# Altium schematic sheet Tactical_LED_Light.SchDoc
size A4
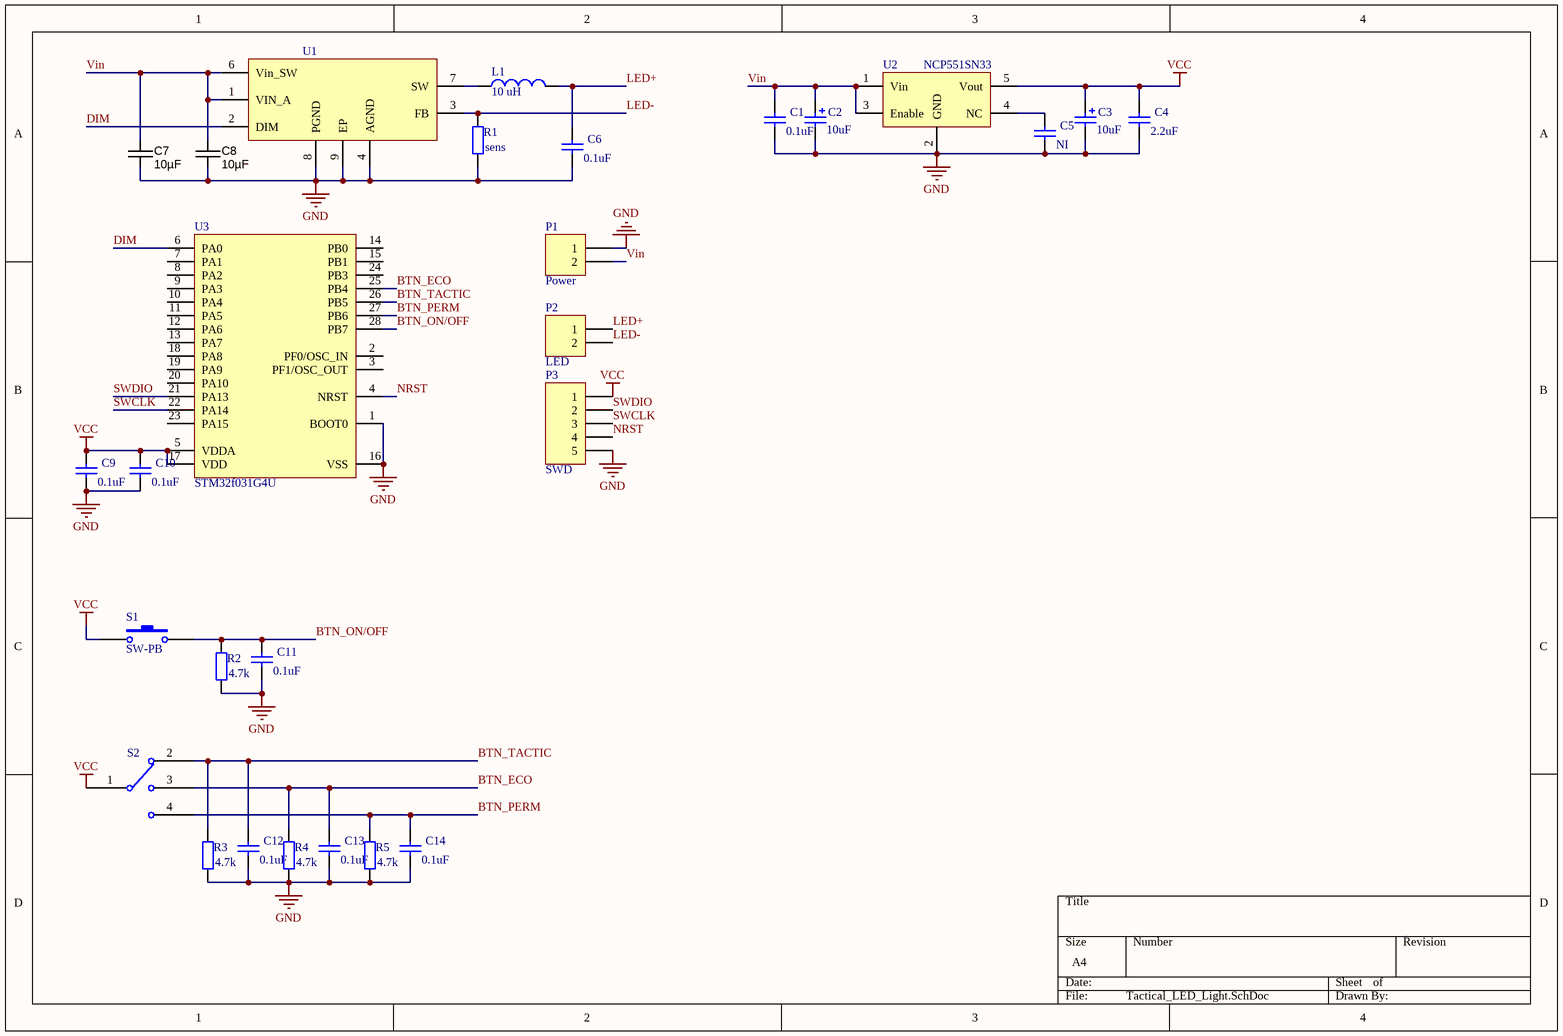
[diagram p0: Tactical_LED_Light.SchDoc]

## Parts
C1  value 0.1uF  [CAPC1608X90N]  (hidden comment: Cap)
C2  value 10uF  [CAPMP3528X210N]  (hidden comment: Cap Pol2)
C3  value 10uF  [CAPMP3528X210N]  (hidden comment: Cap Pol2)
C4  value 2.2uF  [CAPC1608X90N]  (hidden comment: Cap)
C5  value NI  [CAPC1608X90N]  (hidden comment: Cap)
C6  value 0.1uF  [CAPC1608X90N]  (hidden comment: Cap)
C7  10µF  [CAPC3216X100N]
C8  10µF  [CAPC3216X100N]
C9  value 0.1uF  [CAPC1608X90N]  (hidden comment: Cap)
C10  value 0.1uF  [CAPC1608X90N]  (hidden comment: Cap)
C11  value 0.1uF  [CAPC1608X90N]  (hidden comment: Cap)
C12  value 0.1uF  [CAPC1608X90N]  (hidden comment: Cap)
C13  value 0.1uF  [CAPC1608X90N]  (hidden comment: Cap)
C14  value 0.1uF  [CAPC1608X90N]  (hidden comment: Cap)
L1  value 10 uH  [IND_CRDH123]  (hidden comment: Inductor)
P1  Power  [HDR1X2]
P2  LED  [HDR_1x2]
P3  SWD  [HDR1X5]
R1  value sens  [RESC6332X70N]  (hidden comment: Res2)
R2  value 4.7k  [RESC1608X55N]  (hidden comment: Res2)
R3  value 4.7k  [RESC1608X55N]  (hidden comment: Res2)
R4  value 4.7k  [RESC1608X55N]  (hidden comment: Res2)
R5  value 4.7k  [RESC1608X55N]  (hidden comment: Res2)
S1  SW-PB  [HDR1X2]
S2  3-Pos Switch  [TSSM1032C3]  (value not drawn)
U1  LED2001  [LED2001]  (value not drawn)
U2  NCP551SN33
U3  STM32f031G4U  [Quad28]

## Nets
GND: C1.1 C2.2 C3.2 C4.1 C5.1 C6.1 C7.2 C8.2 C9.1 C10.1 C11.1 C12.1 C13.1 C14.1 P1.1 P3.5 R1.1 R2.1 R3.1 R4.1 R5.1 U1.4(AGND) U1.8(PGND) U1.9(EP) U2.2(GND) U3.1(BOOT0) U3.16(VSS)
VCC: C3.1 C4.2 C9.2 C10.2 P3.1 S1.1 S2.1 U2.5(Vout) U3.5(VDDA) U3.17(VDD)
BTN_ECO: C13.2 R4.2 S2.3 U3.25(PB4)
BTN_ON/OFF: C11.2 R2.2 S1.2 U3.28(PB7)
BTN_PERM: C14.2 R5.2 S2.4 U3.27(PB6)
BTN_TACTIC: C12.2 R3.2 S2.2 U3.26(PB5)
DIM: U1.2(DIM) U3.6(PA0)
LED+: C6.2 L1.2 P2.1
LED-: P2.2 R1.2 U1.3(FB)
NRST: P3.4 U3.4(NRST)
SWCLK: P3.3 U3.22(PA14)
SWDIO: P3.2 U3.21(PA13)
Vin: C1.2 C2.1 C7.1 C8.1 P1.2 U1.1(VIN_A) U1.6(Vin_SW) U2.1(Vin) U2.3(Enable)
NetC5_2: C5.2 U2.4(NC)
NetL1_1: L1.1 U1.7(SW)

Not connected (* = marked no-connect by the designer): U3 2(PF0/OSC_IN) 3(PF1/OSC_OUT) 7(PA1) 8(PA2) 9(PA3) 10(PA4) 11(PA5) 12(PA6) 13(PA7) 14(PB0) 15(PB1) 18(PA8) 19(PA9) 20(PA10) 23(PA15) 24(PB3)

## Library data of the parts
C1 C4-C6 C9-C14 = Cap: Capacitor; Published: 8-Jun-2000; LatestRevisionDate: 17-Jul-2002; LatestRevisionNote: Re-released for DXP Platform.; PackageReference: RAD-0.3; Publisher: Altium Limited; PackageDescription: Radial Cap, Thru-Hole; 2 Leads; 0.3 in Pin Spacing
C2 C3 = Cap Pol2: Polarized Capacitor (Axial); Published: 8-Jun-2000; LatestRevisionDate: 17-Jul-2002; LatestRevisionNote: Re-released for DXP Platform.; PackageReference: POLAR0.8; Publisher: Altium Limited; PackageDescription: Polarized Capacitor; 2 Leads
C7 C8 = CAPC_10u_1210_50V: Capacitor SMD Cer 10uF 20% 16V X5R 1210; Manufacturer 1: Taiyo Yuden; Manufacturer Part Number 1: UMK325BJ106MM-T; Ratings: 50V; X5R; Material: ceramic; SCDType: spec; Package / Case: 1210 (3225 Metric); Tolerance: ±20%; Size / Dimension: 0.126" L x 0.098" W (3.20mm x 2.50mm); Supplier 1: Digi-Key; Supplier Part Number 1: 587-2225-1-ND; Value: 10µF
L1 = Inductor: CDRH125NP-100MC; Code_IEC: 1005; Rule: PcbType=ProtelPcb; Published: 8-Jun-2000; LatestRevisionDate: 29-May-2009; LatestRevisionNote: IPC-7351 Footprint Added.; PackageReference: 0402-A; Publisher: Altium Limited; PackageDescription: Chip Inductor; Code_JEITA: 0402
P1 P2 = Header 2: Header, 2-Pin; LatestRevisionDate: 17-Jul-2002; LatestRevisionNote: Re-released for DXP Platform.; Publisher: Altium Limited
P3 = Header 5: Header, 5-Pin; LatestRevisionDate: 17-Jul-2002; LatestRevisionNote: Re-released for DXP Platform.; Publisher: Altium Limited
R1-R5 = Res2: Resistor; Published: 8-Jun-2000; LatestRevisionDate: 17-Jul-2002; LatestRevisionNote: Re-released for DXP Platform.; PackageReference: AXIAL-0.4; Publisher: Altium Limited; PackageDescription: Axial Device, Thru-Hole; 2 Leads; 0.4 in Pin Spacing
S1 = SW-PB: Switch; Published: 24-Mar-1999; LatestRevisionDate: 17-Jul-2002; LatestRevisionNote: Re-released for DXP Platform.; PackageReference: SPST-2; Publisher: Altium Limited; PackageDescription: Switch; 2 Leads
S2 = 3-Pos Switch: 3 position switch
U1 = LED2001: LED Driver 4A
U3 = STM32f031G4U: UFQFPN28